# Altium schematic sheet Sheet_1_2025-12-19.schdoc
size 200 x 220 mm
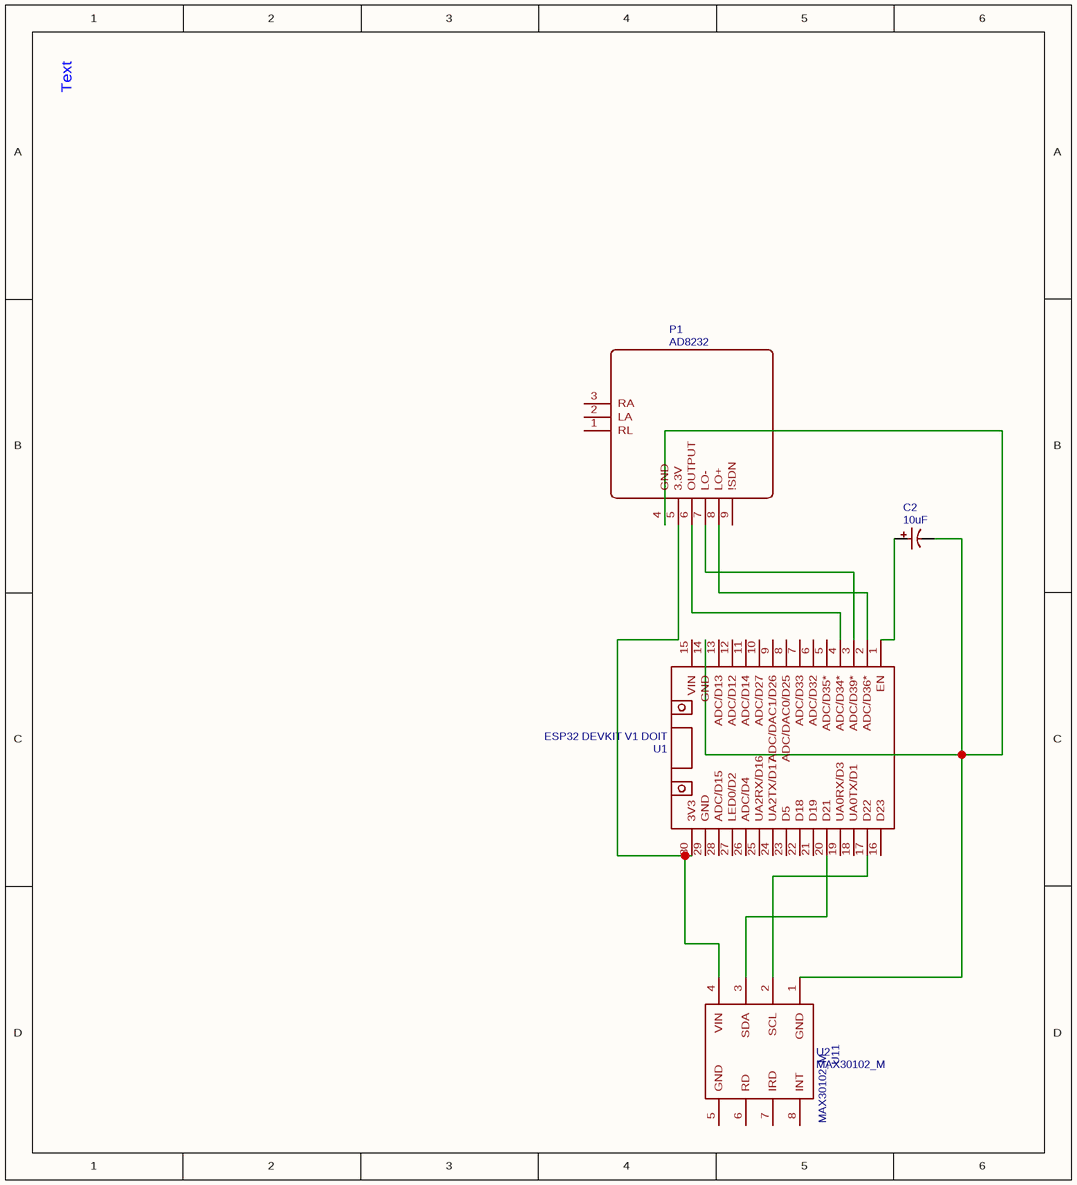
[diagram p0: Sheet_1_2025-12-19.schdoc]

## Parts
C2  10uF  [100UF CAPACITOR, 2.54MM PIN CAPACITOR]
P1  AD8232  [AD8232]
U1  ESP32 DEVKIT V1 DOIT  [DOIT-ESP32-DEVKIT-V1]
U2  MAX30102_M  [MAX30102_RE]

## Nets
NetC2_1: C2.1 U1.1(EN)
NetC2_2: C2.2 P1.4(GND) U1.14(GND) U2.1(GND)
NetP1_5: P1.5(3.3V) U1.30(3V3) U2.4(VIN)
NetP1_6: P1.6(OUTPUT) U1.4(ADC/D34*)
NetP1_7: P1.7(LO-) U1.3(ADC/D39*)
NetP1_8: P1.8(LO+) U1.2(ADC/D36*)
NetU1_17: U1.17(D22) U2.2(SCL)
NetU1_20: U1.20(D21) U2.3(SDA)

Not connected (* = marked no-connect by the designer): P1 1(RL) 2(LA) 3(RA) 9(!SDN); U1 5(ADC/D35*) 6(ADC/D32) 7(ADC/D33) 8(ADC/DAC0/D25) 9(ADC/DAC1/D26) 10(ADC/D27) 11(ADC/D14) 12(ADC/D12) 13(ADC/D13) 15(VIN) 16(D23) 18(UA0TX/D1) 19(UA0RX/D3) 21(D19) 22(D18) 23(D5) 24(UA2TX/D17) 25(UA2RX/D16) 26(ADC/D4) 27(LED0/D2) 28(ADC/D15) 29(GND); U2 5(GND) 6(RD) 7(IRD) 8(INT)

## Notes on the sheet
- (in symbol AD8232) Text
- (in symbol MAX30102_M) U11

## Library data of the parts
C2 = 10uF: Manufacturer: CX(承兴); Manufacturer Part: KM476M016D11RR0VH2FP0; nameAlias: Value; Contributor: Hacket; JLCPCB Part Class: Extended Part; spicePre: C; spiceSymbolName: CAPACITOR COPY
P1 = AD8232: sourceId: 96QK2WNHZ; timeStamp: 1462502171; Supplier Part: 12587; Supplier: SparkFun; spicePre: P; spiceSymbolName: AD8232
U1 = ESP32 DEVKIT V1 DOIT: Contributor: Furkan İLBEYİ; spicePre: U; spiceSymbolName: ESP32 DEVKIT V1 DOIT
U2 = MAX30102_M: Contributor: xconicsembedded; spicePre: U; spiceSymbolName: MAX30102_M